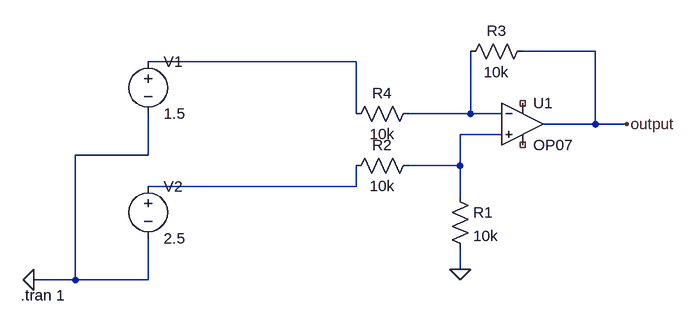
[diagram p0: schematic circuit.asc]
circuit.asc, the LTspice schematic file:
Version 4
SHEET 1 880 680
WIRE 304 48 192 48
WIRE -64 64 -384 64
WIRE -64 144 -64 64
WIRE 112 144 112 48
WIRE 112 144 16 144
WIRE 160 144 112 144
WIRE 304 160 304 48
WIRE 304 160 224 160
WIRE 352 160 304 160
WIRE 160 176 96 176
WIRE -384 208 -384 144
WIRE -384 208 -496 208
WIRE 96 224 96 176
WIRE 96 224 16 224
WIRE -64 256 -64 224
WIRE -64 256 -384 256
WIRE 96 272 96 224
WIRE 96 384 96 352
WIRE -496 400 -496 208
WIRE -496 400 -560 400
WIRE -384 400 -384 336
WIRE -384 400 -496 400
FLAG 96 384 0
FLAG 352 160 output
FLAG -560 400 0
SYMBOL OpAmps\\OP07 192 96 R0
SYMATTR InstName U1
SYMBOL res 80 256 R0
SYMATTR InstName R1
SYMATTR Value 10k
SYMATTR SpiceLine tol=1
SYMBOL res 32 208 R90
WINDOW 0 0 56 VBottom 2
WINDOW 3 32 56 VTop 2
SYMATTR InstName R2
SYMATTR Value 10k
SYMATTR SpiceLine tol=1
SYMBOL res 208 32 R90
WINDOW 0 0 56 VBottom 2
WINDOW 3 32 56 VTop 2
SYMATTR InstName R3
SYMATTR Value 10k
SYMATTR SpiceLine tol=1
SYMBOL res 32 128 R90
WINDOW 0 0 56 VBottom 2
WINDOW 3 32 56 VTop 2
SYMATTR InstName R4
SYMATTR Value 10k
SYMATTR SpiceLine tol=1
SYMBOL voltage -384 48 R0
WINDOW 123 0 0 Left 0
WINDOW 39 0 0 Left 0
SYMATTR InstName V1
SYMATTR Value 1.5
SYMBOL voltage -384 240 R0
WINDOW 123 0 0 Left 0
WINDOW 39 0 0 Left 0
SYMATTR InstName V2
SYMATTR Value 2.5
TEXT -580 424 Left 2 !.tran 1

The netlist it stands for:
* circuit.asc
XU1 N003 N002 NC_01 NC_02 output LT1001  ; OP07, pins In+ In- V+ V- OUT
R1 N003 0 10k tol=1
R2 N003 N004 10k tol=1
R3 output N002 10k tol=1
R4 N002 N001 10k tol=1
V1 N001 0 1.5
V2 N004 0 2.5
.tran 1
.lib LTC.lib
.backanno
.end